# Altium schematic sheet DroneSch.SchDoc
size A4
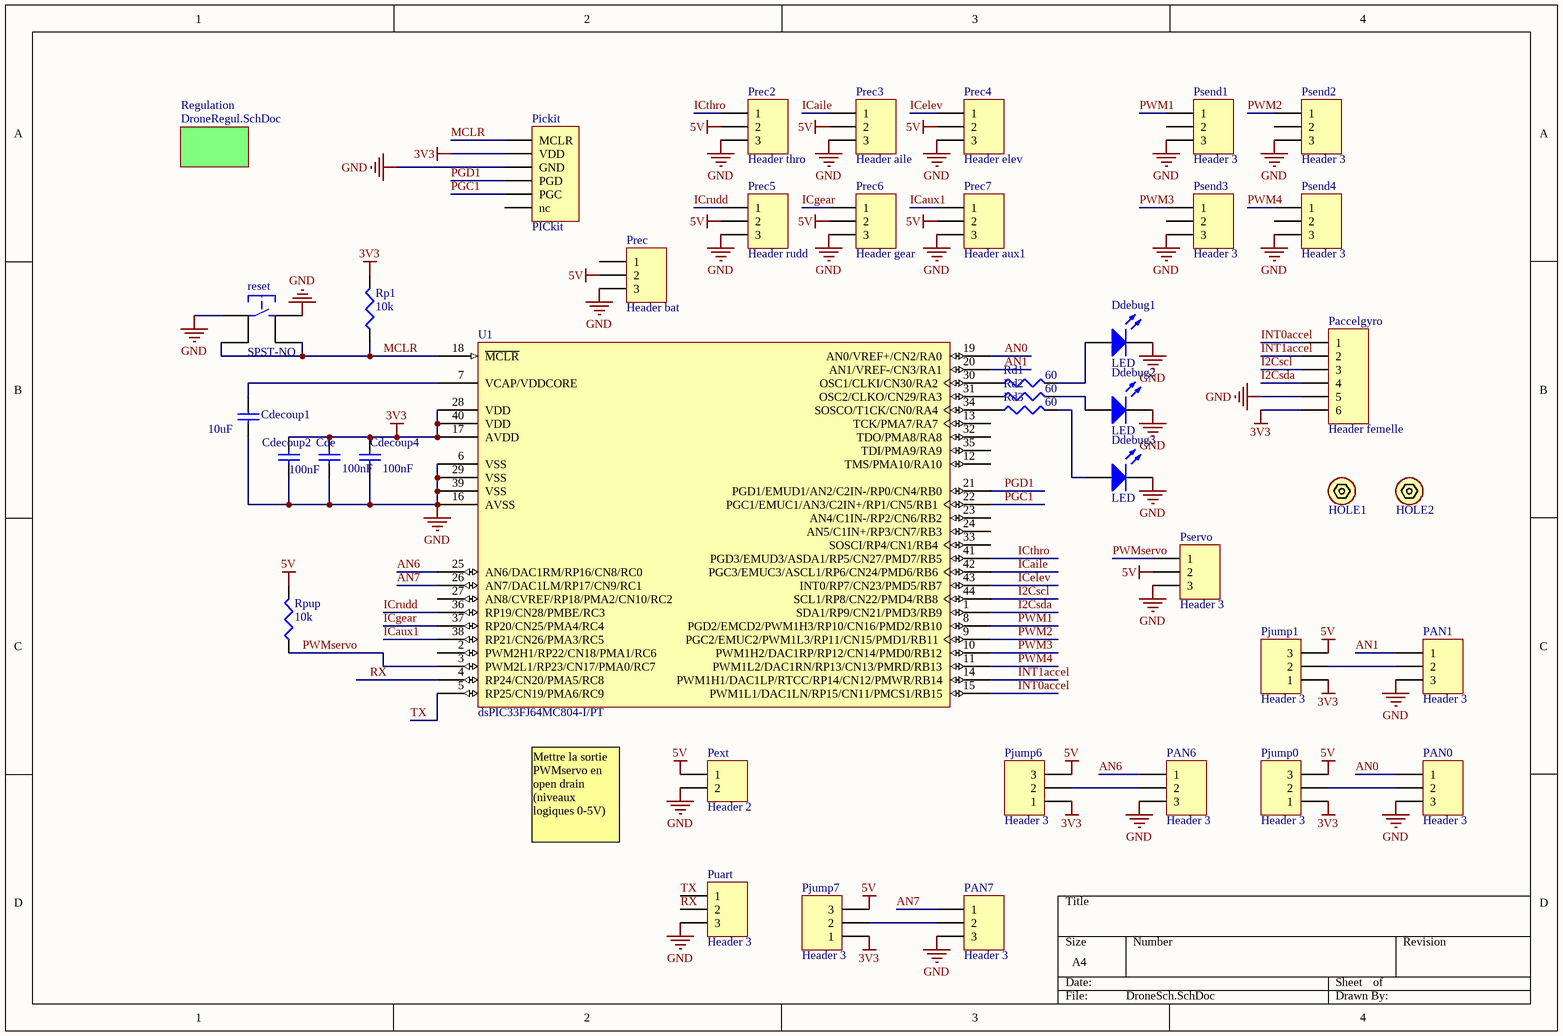
[diagram p0: DroneSch.SchDoc]

## Parts
Cde  value 100nF  [C0805C]  (hidden comment: CAP)
Cdecoup1  value 10uF  [C0805C]  (hidden comment: CAP)
Cdecoup2  value 100nF  [C0805C]  (hidden comment: CAP)
Cdecoup4  value 100nF  [C0805C]  (hidden comment: CAP)
Ddebug1  LED  [LED1206R]
Ddebug2  LED  [LED1206Y]
Ddebug3  LED  [LED1206G]
HOLE1  Hole  [SCREW]  (value not drawn)
HOLE2  Hole  [SCREW]  (value not drawn)
Paccelgyro  Header femelle  [HDR1X6]
PAN0  Header 3  [HDR1X3]
PAN1  Header 3  [HDR1X3]
PAN6  Header 3  [HDR1X3]
PAN7  Header 3  [HDR1X3]
Pext  Header 2  [TERM2W-3.5]
Pickit  PICkit  [HDR1X6H]
Pjump0  Header 3  [HDR1X3]
Pjump1  Header 3  [HDR1X3]
Pjump6  Header 3  [HDR1X3]
Pjump7  Header 3  [HDR1X3]
Prec  Header bat  [HDR1X3]
Prec2  Header thro  [HDR1X3]
Prec3  Header aile  [HDR1X3]
Prec4  Header elev  [HDR1X3]
Prec5  Header rudd  [HDR1X3]
Prec6  Header gear  [HDR1X3]
Prec7  Header aux1  [HDR1X3]
Psend1  Header 3  [HDR1X3]
Psend2  Header 3  [HDR1X3]
Psend3  Header 3  [HDR1X3]
Psend4  Header 3  [HDR1X3]
Pservo  Header 3  [HDR1X3]
Puart  Header 3  [HDR1X3]
Rd1  value 60  [C0805R]  (hidden comment: RES)
Rd2  value 60  [C0805R]  (hidden comment: RES)
Rd3  value 60  [C0805R]  (hidden comment: RES)
reset  SPST-NO  [SPST-NO]
Rp1  value 10k  [C0805R]  (hidden comment: RES)
Rpup  value 10k  [C0805R]  (hidden comment: RES)
U1  dsPIC33FJ64MC804-I/PT  [TQFP-PT44_N]

## Sub-sheets
Regulation = DroneRegul.SchDoc: no entries

## Nets
3V3: Cde.2 Cdecoup2.2 Cdecoup4.2 Paccelgyro.6 Pickit.2(VDD) Pjump0.1 Pjump1.1 Pjump6.1 Pjump7.1 Rp1.2 U1.17(AVDD) U1.28(VDD) U1.40(VDD)
5V: Pext.1 Pjump0.3 Pjump1.3 Pjump6.3 Pjump7.3 Prec.2 Prec2.2 Prec3.2 Prec4.2 Prec5.2 Prec6.2 Prec7.2 Pservo.2 Rpup.2
GND: Cde.1 Cdecoup1.1 Cdecoup2.1 Cdecoup4.1 Ddebug1.2(K) Ddebug2.2(K) Ddebug3.2(K) Paccelgyro.5 PAN0.3 PAN1.3 PAN6.3 PAN7.3 Pext.2 Pickit.3(GND) Prec.3 Prec2.3 Prec3.3 Prec4.3 Prec5.3 Prec6.3 Prec7.3 Psend1.3 Psend2.3 Psend3.3 Psend4.3 Pservo.3 Puart.3 reset.1 reset.4 U1.6(VSS) U1.16(AVSS) U1.29(VSS) U1.39(VSS)
AN0: PAN0.1 U1.19(AN0/VREF+/CN2/RA0)
AN1: PAN1.1 U1.20(AN1/VREF-/CN3/RA1)
AN6: PAN6.1 U1.25(AN6/DAC1RM/RP16/CN8/RC0)
AN7: PAN7.1 U1.26(AN7/DAC1LM/RP17/CN9/RC1)
I2Cscl: Paccelgyro.3 U1.44(SCL1/RP8/CN22/PMD4/RB8)
I2Csda: Paccelgyro.4 U1.1(SDA1/RP9/CN21/PMD3/RB9)
ICaile: Prec3.1 U1.42(PGC3/EMUC3/ASCL1/RP6/CN24/PMD6/RB6)
ICaux1: Prec7.1 U1.38(RP21/CN26/PMA3/RC5)
ICelev: Prec4.1 U1.43(INT0/RP7/CN23/PMD5/RB7)
ICgear: Prec6.1 U1.37(RP20/CN25/PMA4/RC4)
ICrudd: Prec5.1 U1.36(RP19/CN28/PMBE/RC3)
ICthro: Prec2.1 U1.41(PGD3/EMUD3/ASDA1/RP5/CN27/PMD7/RB5)
INT0accel: Paccelgyro.1 U1.15(PWM1L1/DAC1LN/RP15/CN11/PMCS1/RB15)
INT1accel: Paccelgyro.2 U1.14(PWM1H1/DAC1LP/RTCC/RP14/CN12/PMWR/RB14)
MCLR: Pickit.1(MCLR) reset.2 reset.3 Rp1.1 U1.18(~{MCLR})
PGC1: Pickit.5(PGC) U1.22(PGC1/EMUC1/AN3/C2IN+/RP1/CN5/RB1)
PGD1: Pickit.4(PGD) U1.21(PGD1/EMUD1/AN2/C2IN-/RP0/CN4/RB0)
PWM1: Psend1.1 U1.8(PGD2/EMCD2/PWM1H3/RP10/CN16/PMD2/RB10)
PWM2: Psend2.1 U1.9(PGC2/EMUC2/PWM1L3/RP11/CN15/PMD1/RB11)
PWM3: Psend3.1 U1.10(PWM1H2/DAC1RP/RP12/CN14/PMD0/RB12)
PWM4: Psend4.1 U1.11(PWM1L2/DAC1RN/RP13/CN13/PMRD/RB13)
PWMservo: Pservo.1 Rpup.1 U1.3(PWM2L1/RP23/CN17/PMA0/RC7)
RX: Puart.2 U1.4(RP24/CN20/PMA5/RC8)
TX: Puart.1 U1.5(RP25/CN19/PMA6/RC9)
NetCdecoup1_2: Cdecoup1.2 U1.7(VCAP/VDDCORE)
NetDdebug1_1: Ddebug1.1(A) Rd1.2
NetDdebug2_1: Ddebug2.1(A) Rd2.2
NetDdebug3_1: Ddebug3.1(A) Rd3.2
NetPAN0_2: PAN0.2 Pjump0.2
NetPAN1_2: PAN1.2 Pjump1.2
NetPAN6_2: PAN6.2 Pjump6.2
NetPAN7_2: PAN7.2 Pjump7.2
NetRd1_1: Rd1.1 U1.30(OSC1/CLKI/CN30/RA2)
NetRd2_1: Rd2.1 U1.31(OSC2/CLKO/CN29/RA3)
NetRd3_1: Rd3.1 U1.34(SOSCO/T1CK/CN0/RA4)

Not connected (* = marked no-connect by the designer): HOLE1 1(Hole); HOLE2 1(Hole); Pickit 6(nc); Prec 1; Psend1 2; Psend2 2; Psend3 2; Psend4 2; U1 2(PWM2H1/RP22/CN18/PMA1/RC6) 12(TMS/PMA10/RA10) 13(TCK/PMA7/RA7) 23(AN4/C1IN-/RP2/CN6/RB2) 24(AN5/C1IN+/RP3/CN7/RB3) 27(AN8/CVREF/RP18/PMA2/CN10/RC2) 32(TDO/PMA8/RA8) 33(SOSCI/RP4/CN1/RB4) 35(TDI/PMA9/RA9)

## Notes on the sheet
- Mettre la sortie PWMservo en open drain (niveaux logiques 0-5V)

## Library data of the parts
Cde Cdecoup1 Cdecoup2 Cdecoup4 = CAP: Capacitor; Published: 8-Jun-2000; LatestRevisionDate: 29-May-2009; LatestRevisionNote: IPC-7351 Footprint Added.; PackageReference: C1206; Publisher: Altium Limited; PackageDescription: Chip Capacitor
Ddebug1-Ddebug3 = LED: Typical LED; Published: 8-Jun-2000; LatestRevisionDate: 17-Jul-2002; LatestRevisionNote: Re-released for DXP Platform.; PackageVersion: Feb-2002; PackageReference: 3.2X1.6X1.1; Publisher: Altium Limited; PackageDescription: SM LED; 2 Flat Leads
HOLE1 HOLE2 = Hole: Mounting Hole for screws
Paccelgyro = Header 6: Header, 6-Pin; LatestRevisionDate: 17-Jul-2002; LatestRevisionNote: Re-released for DXP Platform.; Publisher: Altium Limited
PAN0 PAN1 PAN6 PAN7 Pjump0 Pjump1 Pjump6 Pjump7 Prec Prec2-Prec7 Psend1-Psend4 Pservo Puart = Header 3: Header, 3-Pin; LatestRevisionDate: 17-Jul-2002; LatestRevisionNote: Re-released for DXP Platform.; Publisher: Altium Limited
Pext = Header 2: Header, 2-Pin; LatestRevisionDate: 17-Jul-2002; LatestRevisionNote: Re-released for DXP Platform.; Publisher: Altium Limited
Pickit = Header ICSP: Header, 6-Pin, Right Angle; LatestRevisionDate: 17-Jul-2002; LatestRevisionNote: Re-released for DXP Platform.; Publisher: Altium Limited
Rd1-Rd3 Rp1 Rpup = RES: Resistor; Published: 8-Jun-2000; LatestRevisionDate: 29-May-2009; LatestRevisionNote: IPC-7351 Footprint Added.; PackageReference: J1-0603; Publisher: Altium Limited; PackageDescription: Chip Resistor
reset = SPST-NO: Tactile Switch 7.3mm, SMD
U1 = dsPIC33FJ64MC804-I/PT: High-Performance 16-bit Digital Signal Controller, 64 KB Flash, 16 KB RAM, 44-Pin TQFP, Industrial Temperature; Published: 2-Dec-2009; DatasheetVersion: revD, Nov-2009; PackageVersion: revBB, Aug-2009; PackageReference: TQFP-PT44; Publisher: Altium Limited; PackageDescription: 44-Lead Plastic Thin Quad Flatpack (PT) - 10x10x1mm Body, 2.00mm [TQFP]; Supplier 1: Digi-Key; Supplier Part Number 1: DSPIC33FJ64MC804-I/PT-ND; Supplier 2: Farnell; Supplier Part Number 2: 1576844; Code_JEDEC: MS-026; ComponentLink1Description: Datasheet; ComponentLink1URL: http://ww1.microchip.com/downloads/en/DeviceDoc/70291D.pdf; ComponentLink2Description: Packaging Specification; ComponentLink2URL: http://www.microchip.com/stellent/groups/techpub_sg/documents/packagingspec/en012702.pdf; ComponentLink3Description: Microchip.com Home; ComponentLink3URL: http://www.microchip.com/